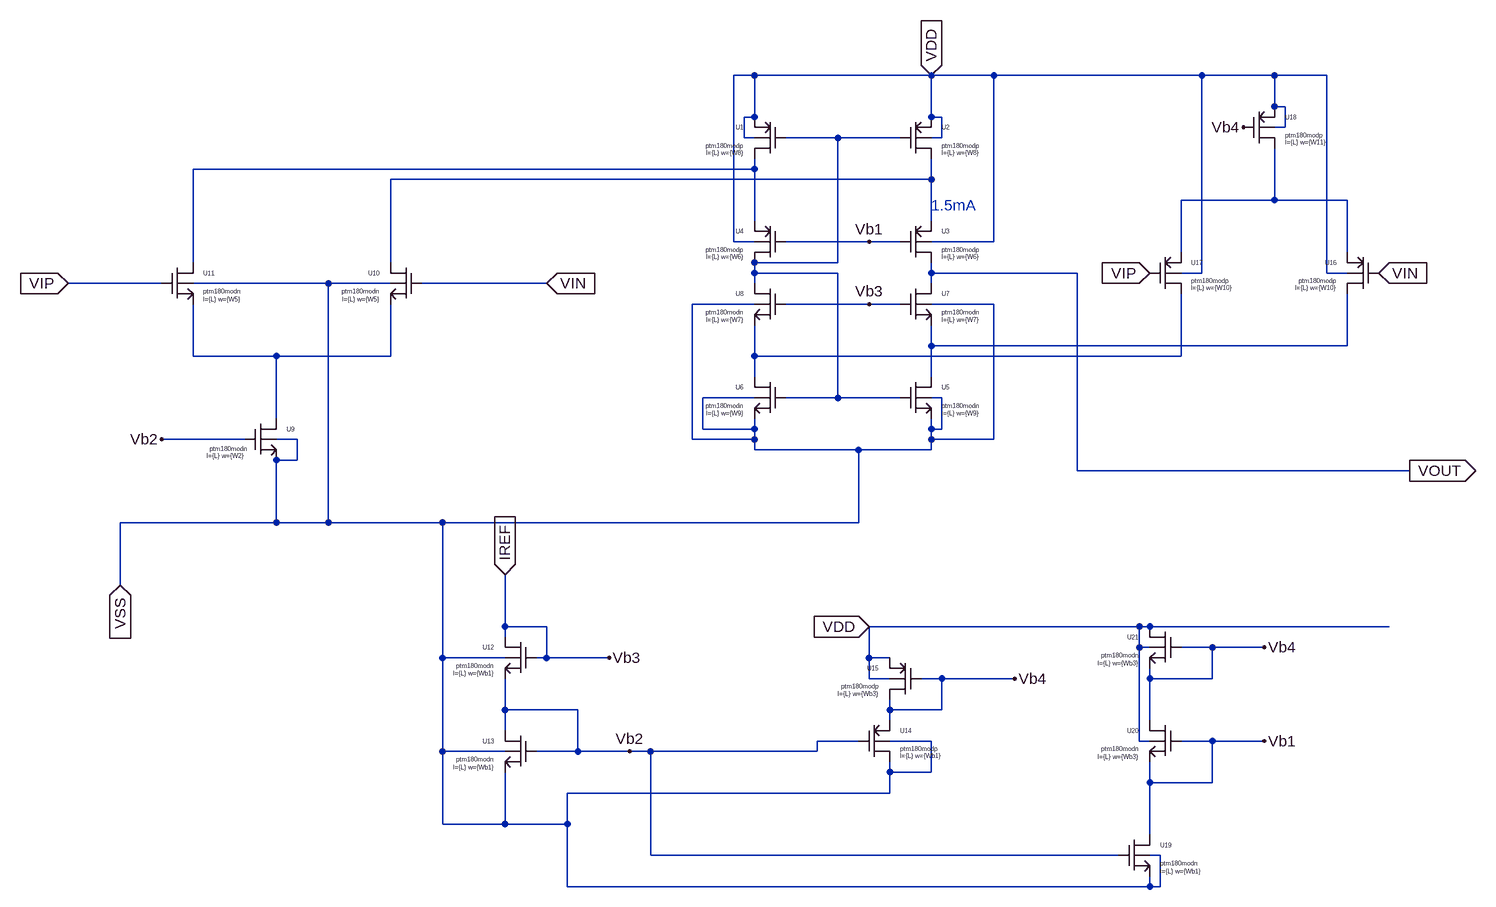
[diagram p0: schematic folded_cascode.asc]
folded_cascode.asc, the LTspice schematic file:
Version 4
SHEET 1 1644 1112
WIRE 320 -448 288 -448
WIRE 592 -448 320 -448
WIRE 688 -448 592 -448
WIRE 1008 -448 688 -448
WIRE 1120 -448 1008 -448
WIRE 1200 -448 1120 -448
WIRE 1120 -400 1120 -448
WIRE 1136 -400 1120 -400
WIRE 320 -384 320 -448
WIRE 320 -384 304 -384
WIRE 592 -384 592 -448
WIRE 608 -384 592 -384
WIRE 1136 -368 1136 -400
WIRE 1136 -368 1120 -368
WIRE 304 -352 304 -384
WIRE 320 -352 304 -352
WIRE 448 -352 368 -352
WIRE 544 -352 448 -352
WIRE 608 -352 608 -384
WIRE 608 -352 592 -352
WIRE 320 -304 320 -320
WIRE 320 -304 -544 -304
WIRE 592 -288 592 -320
WIRE 592 -288 -240 -288
WIRE 1120 -256 1120 -336
WIRE 1120 -256 976 -256
WIRE 1232 -256 1120 -256
WIRE 320 -224 320 -304
WIRE 592 -224 592 -288
WIRE 288 -192 288 -448
WIRE 320 -192 288 -192
WIRE 496 -192 368 -192
WIRE 544 -192 496 -192
WIRE 688 -192 688 -448
WIRE 688 -192 592 -192
WIRE 976 -176 976 -256
WIRE 1232 -176 1232 -256
WIRE -544 -160 -544 -304
WIRE -240 -160 -240 -288
WIRE 448 -160 448 -352
WIRE 448 -160 320 -160
WIRE 320 -144 320 -160
WIRE 448 -144 320 -144
WIRE 592 -144 592 -160
WIRE 816 -144 592 -144
WIRE 1008 -144 1008 -448
WIRE 1008 -144 976 -144
WIRE 1200 -144 1200 -448
WIRE 1232 -144 1200 -144
WIRE -592 -128 -736 -128
WIRE -336 -128 -544 -128
WIRE -240 -128 -336 -128
WIRE 0 -128 -192 -128
WIRE 320 -128 320 -144
WIRE 592 -128 592 -144
WIRE 320 -96 224 -96
WIRE 496 -96 368 -96
WIRE 544 -96 496 -96
WIRE 688 -96 592 -96
WIRE 592 -32 592 -64
WIRE 1232 -32 1232 -112
WIRE 1232 -32 592 -32
WIRE -544 -16 -544 -96
WIRE -416 -16 -544 -16
WIRE -240 -16 -240 -96
WIRE -240 -16 -416 -16
WIRE 320 -16 320 -64
WIRE 976 -16 976 -112
WIRE 976 -16 320 -16
WIRE 320 16 320 -16
WIRE 592 16 592 -32
WIRE 320 48 240 48
WIRE 448 48 448 -144
WIRE 448 48 368 48
WIRE 544 48 448 48
WIRE 608 48 592 48
WIRE -416 80 -416 -16
WIRE 240 96 240 48
WIRE 320 96 320 80
WIRE 320 96 240 96
WIRE 592 96 592 80
WIRE 608 96 608 48
WIRE 608 96 592 96
WIRE -464 112 -592 112
WIRE -384 112 -416 112
WIRE 224 112 224 -96
WIRE 320 112 320 96
WIRE 320 112 224 112
WIRE 592 112 592 96
WIRE 688 112 688 -96
WIRE 688 112 592 112
WIRE 320 128 320 112
WIRE 480 128 320 128
WIRE 592 128 592 112
WIRE 592 128 480 128
WIRE -384 144 -384 112
WIRE -384 144 -416 144
WIRE 816 160 816 -144
WIRE 1328 160 816 160
WIRE -416 240 -416 144
WIRE -416 240 -656 240
WIRE -336 240 -336 -128
WIRE -336 240 -416 240
WIRE -160 240 -336 240
WIRE 480 240 480 128
WIRE 480 240 -160 240
WIRE -656 336 -656 240
WIRE -64 400 -64 320
WIRE 0 400 -64 400
WIRE 912 400 496 400
WIRE 928 400 912 400
WIRE 1296 400 928 400
WIRE -64 416 -64 400
WIRE 912 432 912 400
WIRE 928 432 912 432
WIRE 1024 432 976 432
WIRE 1104 432 1024 432
WIRE -160 448 -160 240
WIRE -64 448 -160 448
WIRE 0 448 0 400
WIRE 0 448 -16 448
WIRE 96 448 0 448
WIRE 496 448 496 400
WIRE 528 448 496 448
WIRE 496 480 496 448
WIRE 528 480 496 480
WIRE 608 480 576 480
WIRE 720 480 608 480
WIRE 928 480 928 464
WIRE 1024 480 1024 432
WIRE 1024 480 928 480
WIRE -64 528 -64 480
WIRE 48 528 -64 528
WIRE 528 528 528 512
WIRE 608 528 608 480
WIRE 608 528 528 528
WIRE 528 544 528 528
WIRE 928 544 928 480
WIRE -64 560 -64 528
WIRE 480 576 416 576
WIRE 592 576 528 576
WIRE 912 576 912 432
WIRE 928 576 912 576
WIRE 1024 576 976 576
WIRE 1104 576 1024 576
WIRE -160 592 -160 448
WIRE -64 592 -160 592
WIRE 48 592 48 528
WIRE 48 592 -16 592
WIRE 128 592 48 592
WIRE 160 592 128 592
WIRE 416 592 416 576
WIRE 416 592 160 592
WIRE 528 624 528 608
WIRE 592 624 592 576
WIRE 592 624 528 624
WIRE 928 640 928 608
WIRE 1024 640 1024 576
WIRE 1024 640 928 640
WIRE 528 656 528 624
WIRE 528 656 32 656
WIRE -160 704 -160 592
WIRE -64 704 -64 624
WIRE -64 704 -160 704
WIRE 32 704 32 656
WIRE 32 704 -64 704
WIRE 928 720 928 640
WIRE 160 752 160 592
WIRE 880 752 160 752
WIRE 944 752 928 752
WIRE 32 800 32 704
WIRE 928 800 928 784
WIRE 928 800 32 800
WIRE 944 800 944 752
WIRE 944 800 928 800
FLAG 592 -448 VDD
IOPIN 592 -448 In
FLAG 0 -128 VIN
IOPIN 0 -128 In
FLAG -736 -128 VIP
IOPIN -736 -128 In
FLAG -656 336 VSS
IOPIN -656 336 In
FLAG 496 -192 Vb1
FLAG 496 -96 Vb3
FLAG -64 320 IREF
IOPIN -64 320 In
FLAG 96 448 Vb3
FLAG 496 400 VDD
IOPIN 496 400 In
FLAG 720 480 Vb4
FLAG 1280 -144 VIN
IOPIN 1280 -144 In
FLAG 928 -144 VIP
IOPIN 928 -144 In
FLAG -592 112 Vb2
FLAG 1072 -368 Vb4
FLAG 128 592 Vb2
FLAG 1104 432 Vb4
FLAG 1104 576 Vb1
FLAG 1328 160 VOUT
IOPIN 1328 160 Out
SYMBOL cnm25mod_pmos4 368 -384 M0
SYMATTR InstName U1
SYMATTR SpiceModel ptm180modp
SYMATTR Value l={L} w={W8}
SYMBOL cnm25mod_pmos4 544 -384 R0
SYMATTR InstName U2
SYMATTR SpiceModel ptm180modp
SYMATTR Value l={L} w={W8}
SYMBOL cnm25mod_pmos4 544 -224 R0
SYMATTR InstName U3
SYMATTR SpiceModel ptm180modp
SYMATTR Value l={L} w={W6}
SYMBOL cnm25mod_pmos4 368 -224 M0
SYMATTR InstName U4
SYMATTR SpiceModel ptm180modp
SYMATTR Value l={L} w={W6}
SYMBOL cnm25mod_nmos4 544 16 R0
SYMATTR InstName U5
SYMATTR SpiceModel ptm180modn
SYMATTR Value l={L} w={W9}
SYMBOL cnm25mod_nmos4 368 16 M0
SYMATTR InstName U6
SYMATTR SpiceModel ptm180modn
SYMATTR Value l={L} w={W9}
SYMBOL cnm25mod_nmos4 544 -128 R0
SYMATTR InstName U7
SYMATTR SpiceModel ptm180modn
SYMATTR Value l={L} w={W7}
SYMBOL cnm25mod_nmos4 368 -128 M0
SYMATTR InstName U8
SYMATTR SpiceModel ptm180modn
SYMATTR Value l={L} w={W7}
SYMBOL cnm25mod_nmos4 -464 80 R0
WINDOW 38 -54 46 Left 0
WINDOW 3 -59 57 Left 0
SYMATTR SpiceModel ptm180modn
SYMATTR Value l={L} w={W2}
SYMATTR InstName U9
SYMBOL cnm25mod_nmos4 -192 -160 M0
SYMATTR SpiceModel ptm180modn
SYMATTR Value l={L} w={W5}
SYMATTR InstName U10
SYMBOL cnm25mod_nmos4 -592 -160 R0
SYMATTR SpiceModel ptm180modn
SYMATTR Value l={L} w={W5}
SYMATTR InstName U11
SYMBOL cnm25mod_nmos4 -16 416 M0
SYMATTR SpiceModel ptm180modn
SYMATTR InstName U12
SYMATTR Value l={L} w={Wb1}
SYMBOL cnm25mod_nmos4 -16 560 M0
SYMATTR SpiceModel ptm180modn
SYMATTR InstName U13
SYMATTR Value l={L} w={Wb1}
SYMBOL cnm25mod_pmos4 480 544 R0
SYMATTR SpiceModel ptm180modp
SYMATTR Value l={L} w={Wb1}
SYMATTR InstName U14
SYMBOL cnm25mod_pmos4 576 448 M0
SYMATTR SpiceModel ptm180modp
SYMATTR Value l={L} w={Wb3}
SYMATTR InstName U15
SYMBOL cnm25mod_pmos4 1280 -176 M0
SYMATTR SpiceModel ptm180modp
SYMATTR Value l={L} w={W10}
SYMATTR InstName U16
SYMBOL cnm25mod_pmos4 928 -176 R0
SYMATTR SpiceModel ptm180modp
SYMATTR Value l={L} w={W10}
SYMATTR InstName U17
SYMBOL cnm25mod_pmos4 1072 -400 R0
SYMATTR SpiceModel ptm180modp
SYMATTR Value l={L} w={W11}
SYMATTR InstName U18
SYMBOL cnm25mod_nmos4 880 720 R0
SYMATTR SpiceModel ptm180modn
SYMATTR InstName U19
SYMATTR Value l={L} w={Wb1}
SYMBOL cnm25mod_nmos4 976 544 M0
SYMATTR SpiceModel ptm180modn
SYMATTR InstName U20
SYMATTR Value l={L} w={Wb3}
SYMBOL cnm25mod_nmos4 976 400 M0
SYMATTR SpiceModel ptm180modn
SYMATTR InstName U21
SYMATTR Value l={L} w={Wb3}
TEXT 592 -248 Left 2 ;1.5mA

The netlist it stands for:
* folded_cascode.asc
XU1 N002 N001 VDD VDD ptm180modp l={L} w={W8}  ; pins D G S B
XU2 N003 N001 VDD VDD ptm180modp l={L} w={W8}  ; pins D G S B
XU3 VOUT Vb1 N003 VDD ptm180modp l={L} w={W6}  ; pins D G S B
XU4 N001 Vb1 N002 VDD ptm180modp l={L} w={W6}  ; pins D G S B
XU5 N005 N001 VSS VSS ptm180modn l={L} w={W9}  ; pins D G S B
XU6 N007 N001 VSS VSS ptm180modn l={L} w={W9}  ; pins D G S B
XU7 VOUT IREF N005 VSS ptm180modn l={L} w={W7}  ; pins D G S B
XU8 N001 IREF N007 VSS ptm180modn l={L} w={W7}  ; pins D G S B
XU9 N006 Vb2 VSS VSS ptm180modn l={L} w={W2}  ; pins D G S B
XU10 N003 VIN N006 VSS ptm180modn l={L} w={W5}  ; pins D G S B
XU11 N002 VIP N006 VSS ptm180modn l={L} w={W5}  ; pins D G S B
XU12 IREF IREF Vb2 VSS ptm180modn l={L} w={Wb1}  ; pins D G S B
XU13 Vb2 Vb2 VSS VSS ptm180modn l={L} w={Wb1}  ; pins D G S B
XU14 VSS Vb2 Vb4 VSS ptm180modp l={L} w={Wb1}  ; pins D G S B
XU15 Vb4 Vb4 VDD VDD ptm180modp l={L} w={Wb3}  ; pins D G S B
XU16 N005 VIN N004 VDD ptm180modp l={L} w={W10}  ; pins D G S B
XU17 N007 VIP N004 VDD ptm180modp l={L} w={W10}  ; pins D G S B
XU18 N004 Vb4 VDD VDD ptm180modp l={L} w={W11}  ; pins D G S B
XU19 Vb1 Vb2 VSS VSS ptm180modn l={L} w={Wb1}  ; pins D G S B
XU20 Vb4 Vb1 Vb1 VDD ptm180modn l={L} w={Wb3}  ; pins D G S B
XU21 VDD Vb4 Vb4 VDD ptm180modn l={L} w={Wb3}  ; pins D G S B
* 1.5mA
.backanno
.end